# Altium schematic sheet DCDCsim.SchDoc
size Tabloid; SheetNumber: 1; SheetTotal: 1; SPICEModelCacheLJWPDLZX: <root> / <DocumentId>LJWPDLZX</DocumentId> / <CacheFrame Number="0"> / <Model Name="dsbas16xv2t1g" Kind="MDL"> / <Text>************************************** / *      Model Generated by MODPEX     * / *Copyright(c) Symmetry Design Systems* / *         All Rights Reserved        * / *    UNPUBLISHED LICENSED SOFTWARE   * / *   Contains Proprietary Information * / *      Which is The Property of      * / *     SYMMETRY OR ITS LICENSORS      * / *Commercial Use or Resale Restricted * / *   by Symmetry License Agreement    * / ************************************** / * Model generated on Mar  1, 18 / * MODEL FORMAT: PSpice / .MODEL Dsbas16xv2t1g d / +IS=6.75697e-09 RS=1.11407 N=1.92072 EG=1.17037 / +XTI=0.5 BV=165 IBV=0.0001 CJO=6.03442e-13 / +VJ=2.38765 M=0.1 FC=0.5 TT=5.1937e-09 / +KF=0 AF=1</Text> / </Model> / <Model Name="cout" Kind="CKT"> / <Text>*$ / .SUBCKT Cout 2 4 / R1 2 3 0.0010 / C1 3 1 1.4463631552839E-4 / R3 5 4 150 / R2 2 4 6913892.9344733935 / R4 3 26 222222.22222222222 / R6 3 7 222.22222222222223 / C5 7 1 4.3390894658517E-6 / R7 3 10 22.22222222222222 / C6 10 1 4.3390894658517E-6 / R8 3 13 2.2222222222222223 / C7 13 1 4.3390894658517E-6 / C2 26 1 4.3390894658517E-6 / R9 3 28 22222.222222222223 / C3 28 1 4.3390894658517E-6 / R10 3 29 2222.222222222222 / C4 29 1 4.3390894658517E-6 / L8 1 5 15p / R24 1 5 0.0030 / L12 5 4 1n / .ends</Text> / </Model> / </CacheFrame> / </root>
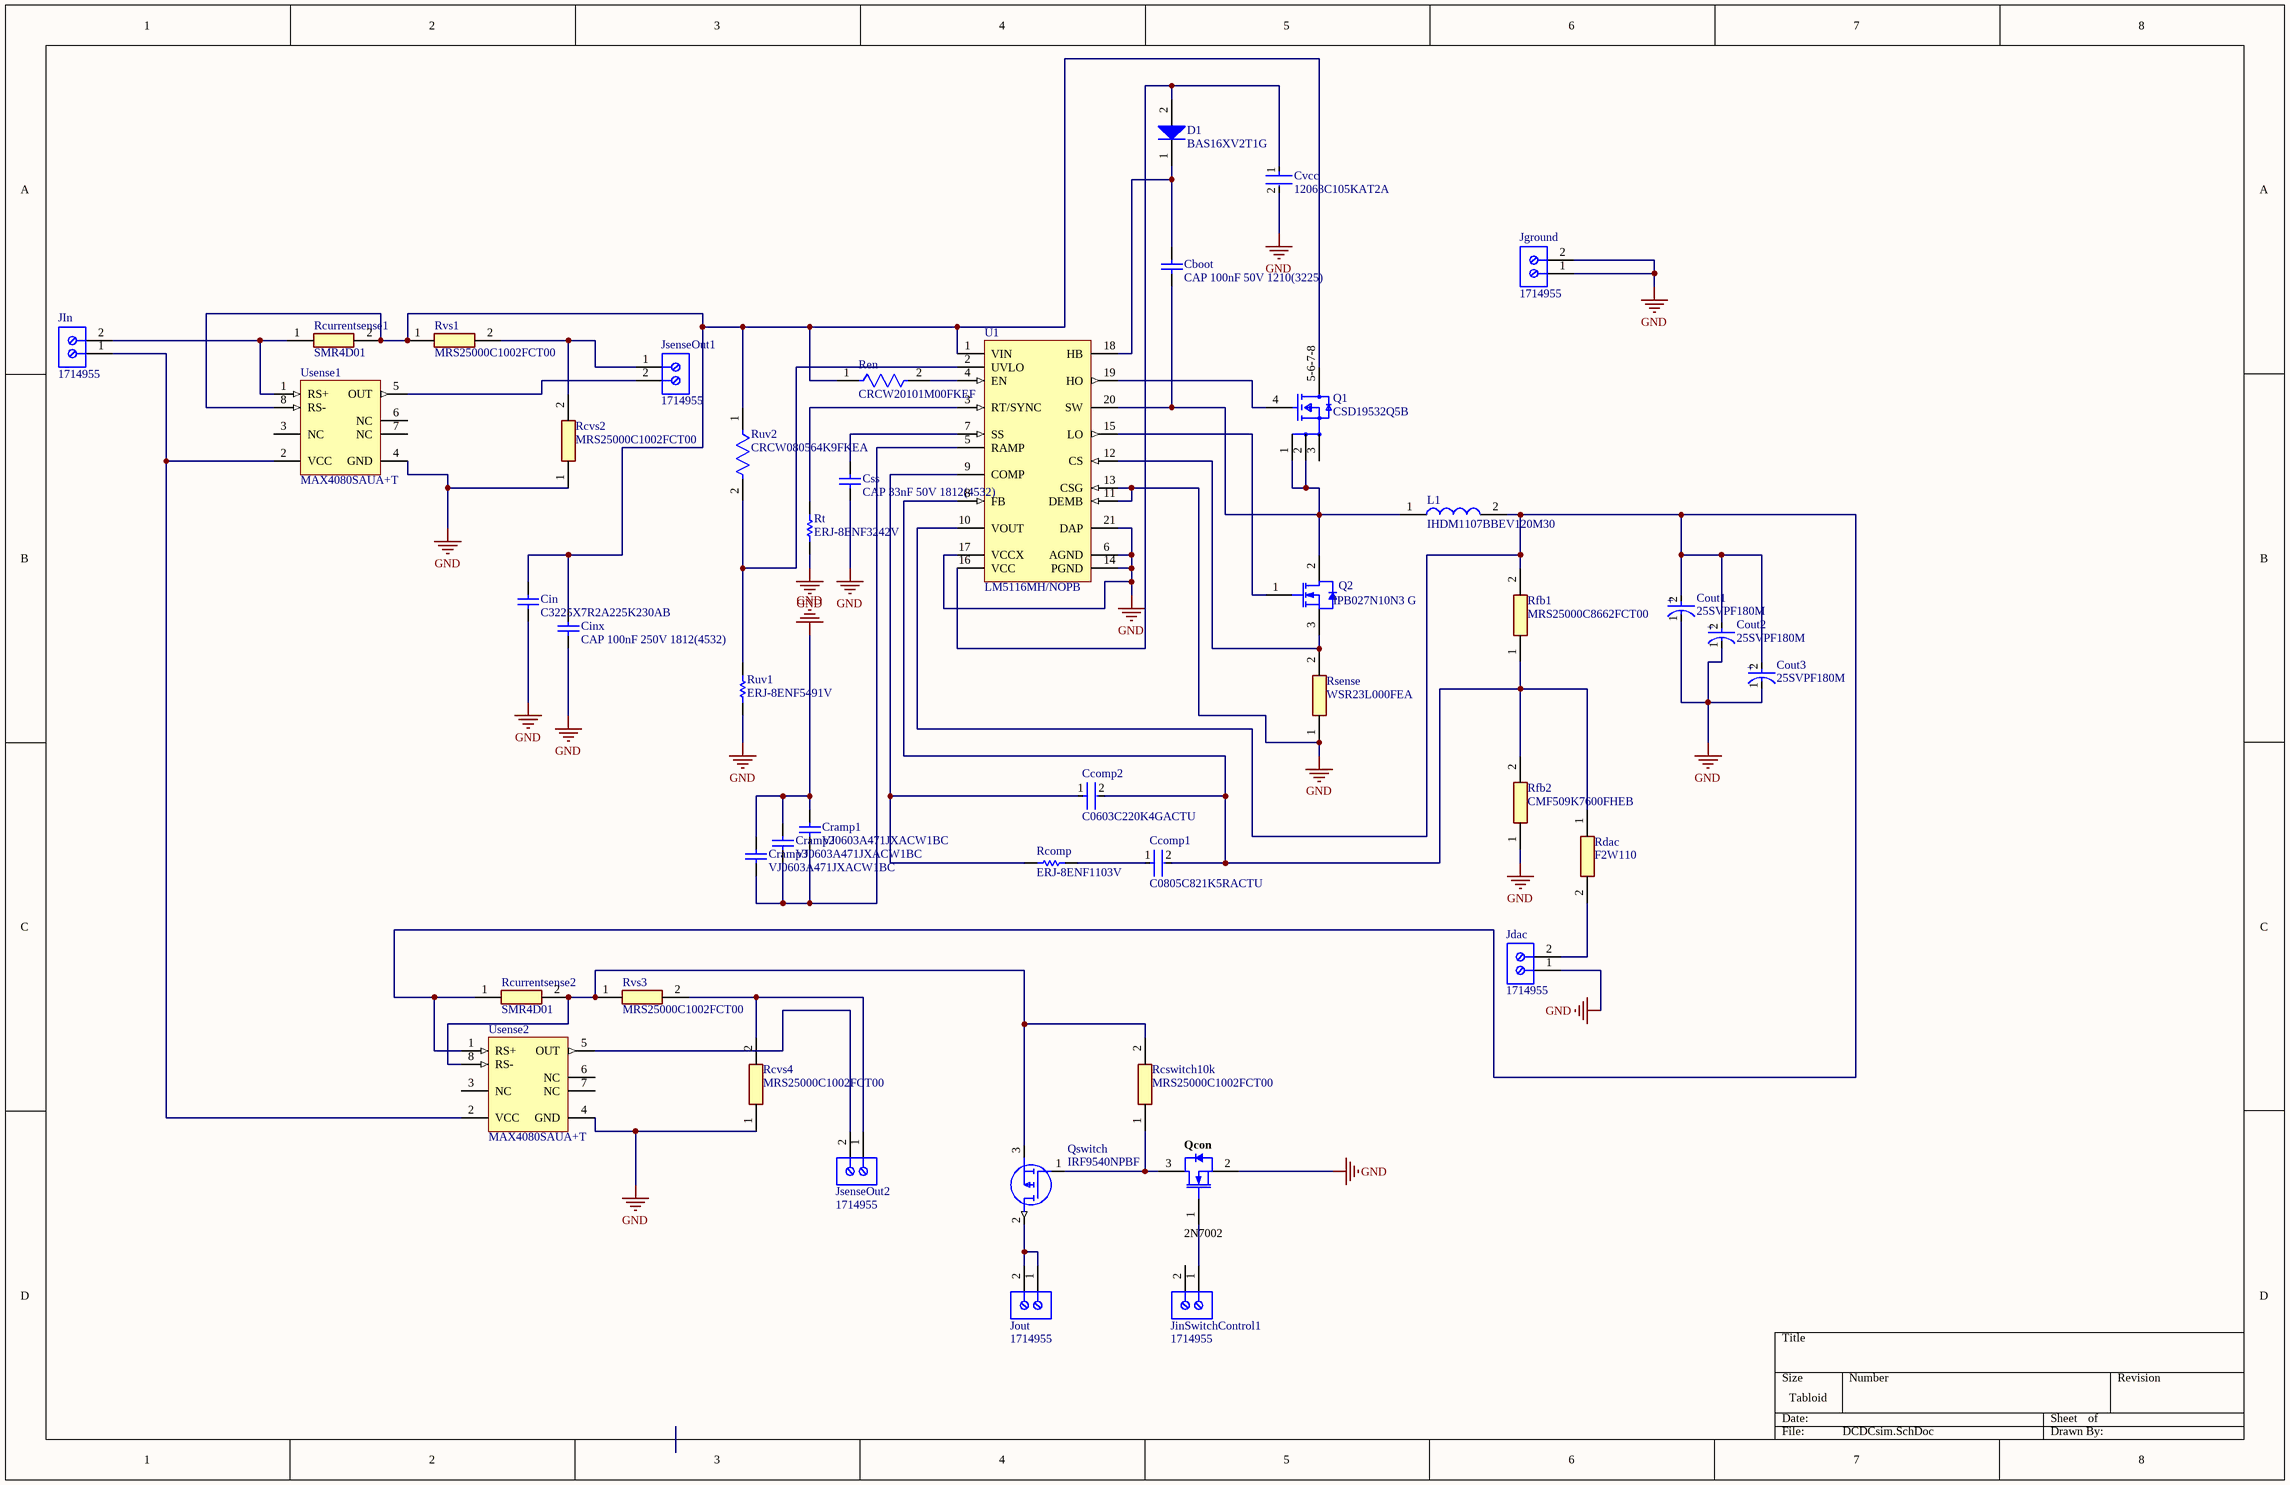
[diagram p0: DCDCsim.SchDoc]

## Parts
Cboot  CAP 100nF 50V 1210(3225)  [CAPC1210(3225)155_M]
Ccomp1  C0805C821K5RACTU  [FP-C0805C-DN-MFG]
Ccomp2  C0603C220K4GACTU  [FP-C0603C-CF-MFG]
Cin  C3225X7R2A225K230AB  [CAPC3225X250X20LL40]
Cinx  CAP 100nF 250V 1812(4532)  [CAPC1812(4532)230_M]
Cout1  25SVPF180M  [FP-OS-CON-SMT-E12-MFG]
Cout2  25SVPF180M  [FP-OS-CON-SMT-E12-MFG]
Cout3  25SVPF180M  [FP-OS-CON-SMT-E12-MFG]
Cramp1  VJ0603A471JXACW1BC  [CAPC1608X87X40ML10T15]
Cramp2  VJ0603A471JXACW1BC  [CAPC1608X87X40ML10T15]
Cramp3  VJ0603A471JXACW1BC  [CAPC1608X87X40ML10T15]
Css  CAP 33nF 50V 1812(4532)  [CAPC1812(4532)125_M]
Cvcc  12063C105KAT2A  [FP-1206-L_3_2_0_2-W_1_6_0-IPC_A]
D1  BAS16XV2T1G  [ONSC-SOD-523-2-502-01_V]
Jdac  1714955  [PHOE-1714955_V]
Jground  1714955  [PHOE-1714955_V]
JIn  1714955  [PHOE-1714955_V]
JinSwitchControl1  1714955  [PHOE-1714955_V]
Jout  1714955  [PHOE-1714955_V]
JsenseOut1  1714955  [PHOE-1714955_V]
JsenseOut2  1714955  [PHOE-1714955_V]
L1  IHDM1107BBEV120M30  [IHDM1107BBEV120M30]
Q1  CSD19532Q5B  [FP-DNK0008A-MFG]
Q2  IPB027N10N3 G  [INF-PG-TO-263-3-2_A_N]
Qcon  2N7002  [INF-PG-SOT23_M]
Qswitch  IRF9540NPBF  [TO254P469X1042X1967-3P]
Rcomp  ERJ-8ENF1103V  [RESC3216X70X50LL05T20]
Rcswitch10k  MRS25000C1002FCT00  [RESAD1650W60L650D250]
Rcurrentsense1  SMR4D01  [SMR4D01]
Rcurrentsense2  SMR4D01  [SMR4D01]
Rcvs2  MRS25000C1002FCT00  [RESAD1650W60L650D250]
Rcvs4  MRS25000C1002FCT00  [RESAD1650W60L650D250]
Rdac  F2W110  [RESAD2780W70L1140D410]
Ren  CRCW20101M00FKEF  [FP-CRCW2010-e3-MFG]
Rfb1  MRS25000C8662FCT00  [RESAD1650W60L650D250]
Rfb2  CMF509K7600FHEB  [RESAD1041W46L381D165]
Rsense  WSR23L000FEA  [RESC11670X254N]
Rt  ERJ-8ENF3242V  [RESC3216X70X50NL05T20]
Ruv1  ERJ-8ENF5491V  [RESC3216X70X50NL05T20]
Ruv2  CRCW080564K9FKEA  [FP-CRCW0805-e3-IPC_C]
Rvs1  MRS25000C1002FCT00  [RESAD1650W60L650D250]
Rvs3  MRS25000C1002FCT00  [RESAD1650W60L650D250]
U1  LM5116MH/NOPB  [PWP0020A_N]
Usense1  MAX4080SAUA+T  [MAXM-U8+1_L]
Usense2  MAX4080SAUA+T  [MAXM-U8+1_L]

## Nets
GND: Cin.1 Cinx.1 Cout1.1(C) Cout2.1(C) Cout3.1(C) Cramp1.2 Cramp2.2 Cramp3.2 Css.1 Cvcc.2 Jdac.1 Jground.1 Jground.2 Qcon.2(SOURCE) Rcvs2.1 Rcvs4.1 Rfb2.1 Rsense.1 Rt.1 Ruv1.1 U1.6(AGND) U1.11(DEMB) U1.13(CSG) U1.14(PGND) U1.17(VCCX) U1.21(DAP) Usense1.4(GND) Usense2.4(GND)
NetCboot_1: Cboot.1 L1.1 Q1.1(S) Q1.2(S) Q2.2(DRAIN) U1.20(SW)
NetCboot_2: Cboot.2 D1.1(K) U1.18(HB)
NetCcomp1_1: Ccomp1.1 Rcomp.2
NetCcomp1_2: Ccomp1.2 Ccomp2.2 Rdac.1 Rfb1.1 Rfb2.2 U1.8(FB)
NetCcomp2_1: Ccomp2.1 Rcomp.1 U1.9(COMP)
NetCin_2: Cin.2 Cinx.2 Q1.5-6-7-8(D) Rcurrentsense1.2 Ren.1 Ruv2.1 Rvs1.1 U1.1(VIN) Usense1.8(RS-)
NetCout1_2: Cout1.2(A) Cout2.2(A) Cout3.2(A) L1.2 Rcurrentsense2.1 Rfb1.2 U1.10(VOUT) Usense2.1(RS+)
NetCramp1_1: Cramp1.1 Cramp2.1 Cramp3.1 U1.5(RAMP)
NetCss_2: Css.2 U1.7(SS)
NetCvcc_1: Cvcc.1 D1.2(A) U1.16(VCC)
NetJdac_2: Jdac.2 Rdac.2
NetJIn_1: JIn.1 Usense1.2(VCC) Usense2.2(VCC)
NetJIn_2: JIn.2 Rcurrentsense1.1 Usense1.1(RS+)
NetJinSwitchControl1_1: JinSwitchControl1.1 Qcon.1(GATE)
NetJout_1: Jout.1 Jout.2 Qswitch.2(D)
NetJsenseOut1_1: JsenseOut1.1 Rcvs2.2 Rvs1.2
NetJsenseOut1_2: JsenseOut1.2 Usense1.5(OUT)
NetJsenseOut2_1: JsenseOut2.1 Rcvs4.2 Rvs3.2
NetJsenseOut2_2: JsenseOut2.2 Usense2.5(OUT)
NetQ1_4: Q1.4(G) U1.19(HO)
NetQ2_1: Q2.1(GATE) U1.15(LO)
NetQ2_3: Q2.3(SOURCE) Rsense.2 U1.12(CS)
NetQcon_3: Qcon.3(DRAIN) Qswitch.1(G) Rcswitch10k.1
NetQswitch_3: Qswitch.3(S) Rcswitch10k.2 Rcurrentsense2.2 Rvs3.1 Usense2.8(RS-)
NetRen_2: Ren.2 U1.4(EN)
NetRt_2: Rt.2 U1.3(RT/SYNC)
NetRuv1_2: Ruv1.2 Ruv2.2 U1.2(UVLO)

Not connected (* = marked no-connect by the designer): JinSwitchControl1 2; Q1 3(S); Usense1 3(NC) 6(NC) 7(NC); Usense2 3(NC) 6(NC) 7(NC)

## Notes on the sheet
- (in symbol CMP-05428-001075-1) +

## Library data of the parts
Cboot = CMP-1038-01650-1: CAP 100nF 50V ±5% 1210 (3225 Metric) Thickness 1.45mm SMD; Case-EIA: 1210; Tolerance: Â±5%; Case-Metric: 3225; Value: 100nF; Technology: SMT; Max Thickness: 1.45 mm; Rated Voltage: 50 V
Ccomp1 = CMP-2007-00409-2: 0805 C 820pF Ceramic Multilayer Capacitor; 50 VDC; +125degC; X7R Dielec; +/-10%; Manufacturer: KEMET; Tolerance: 0.1; Temperature Coefficient: 30ppm/°C; Voltage Rating: 50 V; Automotive: No; Material: Ceramic; Temperature Characteristic: X7R; Manufacturer Part Number: C0805C821K5RACTU; ComponentLink2URL: https://content.kemet.com/datasheets/KEM_C1003_C0G_SMD.pdf; Capacitance: 820 pF; Temperature Range High: +125°C; Category: Cap; Value: 820 pF; Digikey Description: 0805 C 820pF Ceramic Multilayer Capacitor; 50 VDC; +125degC; X7R Dielec; +/-10%; Device Class L2: Capacitors; Package: C0805C-DN; Temperature: -55°C to +125°C; Temperature Range Low: -55°C; Ipc Land Pattern Name: CAPC200125X78; Mouser Description: 0805 C 820pF Ceramic Multilayer Capacitor; 50 VDC; +125degC; X7R Dielec; +/-10%; Device Class L3: Ceramic Capacitors; Height: 0.88mm; Device Class L1: Passive Components; ComponentLink2Description: Datasheet; Lead Free: Yes; RoHS: TRUE; Octopart: https://octopart.com/c0805c821k5ractu-kemet-87425
Ccomp2 = CMP-2006-03465-2: CAP CER 22PF 16V 10% NP0 0603; Manufacturer: KEMET; Temperature Characteristic: C0G; Temperature Coefficient: 30ppm/°C; Tolerance: 0.1; Automotive Grade: Grade 1; ComponentLink2URL: https://api.kemet.com/component-edge/download/datasheet/C0603C100J5GACAUTO.pdf; Mouser Description: Multilayer Ceramic Capacitors MLCC - SMD/SMT 16volts 22pF C0G 10%; Package: C0603C-CF; Height: 0.87mm; Device Class L1: Passive Components; ComponentLink2Description: Datasheet; Device Class L3: Ceramic Capacitors; Device Class L2: Capacitors; Value: 22 pF; Temperature Range High: +125°C; Automotive: Yes; Digikey Description: CAP CER 22PF 16V 10% NP0 0603; Material: Ceramic; Category: Cap; Capacitance: 22 pF; Manufacturer Part Number: C0603C220K4GACTU; RoHS: TRUE; Octopart: https://octopart.com/c0603c220k4gactu-kemet-17097913; Temperature: -55°C to +125°C; Lead Free: Yes; Temperature Range Low: -55°C; Voltage Rating: 16 V
Cin = CMP-2000-06053-1: Chip Capacitor, 2.2 uF, +/- 10%, -55 to 125 degC, 1210 (3225 Metric), RoHS, Tape and Reel; PCN Part Number: MLCCPartNumberChange30/Nov/2012; Manufacturer: TDK; Capacitance: 2.2µF; Catalog Drawings: CSERIES_1210_2.5; Product Training Modules: SEAT,CCV,andTVCLDesignToolsGuidetoReplacinganElectrolyticCapacitorwithanMLCC; Other Names: 445-4497-6; Voltage - Rated: 100V; Temperature Coefficient: X7R; Featured Product: C-SeriesMidVoltageMLCCs; Online Catalog: CSeries,MidVoltage; Ratings: -; Mounting Technology: SurfaceMount; Height - Seated (Max): -; Applications: GeneralPurpose; Packaging: Digi-Reel®; Mounting Type: SurfaceMount,MLCC; Lead Spacing: -; Thickness (Max): 0.098"(2.50mm); Package Reference: 1210 (3225 Metric); Manufacturer URL: http://www.tdk.com/; Size / Dimension: 0.126"Lx0.098"W(3.20mmx2.50mm); Operating Temperature: -55°C~125°C; Datasheet URL: https://datasheet.ciiva.com/15192/getdatasheetpartid-725361-15192330.pdf; RoHS Information: RoHSCertificate-MLCC; Lead Style: -; Standard Package: 1; Family: CeramicCapacitors; Datasheet Version: 10/2014; Category: Capacitors; Tolerance: ±10%; Features: -; Series: C; Package Description: 2-Pin Surface Mount Device, Body 3.2 x 2.5 mm; Package / Case: 1210(3225Metric)
Cinx = CMP-1040-01320-2: CAP 100nF 250V ±10% 1812 (4532 Metric) Thickness 2.3mm SMD; Case-EIA: 1812; Tolerance: Â±10%; Case-Metric: 4532; Value: 100nF; Max Thickness: 2.3 mm; Technology: SMT; Rated Voltage: 250 V
Cout1-Cout3 = CMP-05428-001075-1: Conductive Polymer Aluminum Solid Capacitors (OS-CON) 180uF ±20% 25V; Polarity: Polar; Ripple Current (AC): 4.65A; Dissipation Factor: 12%; ESR (Equivalent Series Resistance): 16mR; Life (Hours): 5000Hour; Leakage Current: 900uA; Voltage Rating (DC): 25V; Height: 11.9mm; REACH SVHC: No SVHC; Number of Pins: 12; Series: OS-CON™, SVPF; Length: 11.9mm; Packaging: Tape and Reel; Case/Package: Radial; Diameter: 8mm; Voltage: 25V; Lead Free: Lead Free; Height - Seated (Max): 0.472inch; Ripple Current: 4.65A; Package Quantity: 400; Tolerance: 20%; Max Operating Temperature: 105°C; RoHS Compliant: Yes; Mount: Surface Mount; Termination: SMD/SMT; Voltage Rating: 25V; Capacitance: 180uF; Min Operating Temperature: -55°C
Cramp1-Cramp3 = CMP-2006-02033-1: Manufacturer: Vitramon; Part Number: VJ0603A471JXACW1BC
Css = CMP-1040-01069-2: CAP 33nF 50V ±5% 1812 (4532 Metric) Thickness 1.25mm SMD; Case-Metric: 4532; Tolerance: Â±5%; Case-EIA: 1812; Max Thickness: 1.25 mm; Rated Voltage: 50 V; Technology: SMT; Value: 33nF
Cvcc = CMP-04427-000096-1: General Purpose Ceramic Capacitor, 1206, 1uF, 10%, X7R, 15%, 25V; Dissipation Factor: 3%; Insulation Resistance: 100GR; Case Code (Metric): 3216; Length: 3.2mm; Size: 1.78mm; Radiation Hardening: No; Construction: Flat; Capacitance: 1uF; Packaging: Tape and Reel; Voltage Rating (DC): 25V; Case Code (Imperial): 1206; Package Quantity: 1; Tolerance: 10%; Voltage Rating: 25V; Lead Free: Lead Free; Height: 1.78mm; Thickness: 0.07inch; Width: 1.6mm; Dielectric: X7R; Voltage: 25V; Contact Plating: Tin; Min Operating Temperature: -55°C; Number of Pins: 2; Series: -; Depth: 1.6mm; REACH SVHC: No SVHC; Case/Package: 1206; RoHS Compliant: Yes; Max Operating Temperature: 125°C; Termination: SMD/SMT; Mount: Surface Mount
D1 = CMP-1054-00076-1: Switching Diode, 2-Pin SOD-523, Pb-Free, Tape and Reel; Manufacturer: On Semiconductor; trr Max (ns): 6; Configuration: Single; IF Max (A): 0.2; ComponentLink1URL: http://www.onsemi.com/; DatasheetVersion: Rev. 7; RoHS: TRUE; PackageVersion: Rev. E, 09/2010; Packing: Tape and Reel; ComponentLink2Description: Datasheet; ComponentLink2URL: http://www.onsemi.com/pub_link/Collateral/BAS16XV2T1-D.PDF; ComponentLink3Description: Package Specification; PackageReference: SOD-523-2-502-01; ComponentLink1Description: Manufacturer URL; PartNumber: BAS16XV2T1G; Mounting Technology: Surface Mount; PackageDescription: 2-Pin SOD, Body 1.2 x 0.8 mm; ComponentLink3URL: http://www.onsemi.com/pub_link/Collateral/502-01.PDF
Jdac Jground JIn JinSwitchControl1 Jout JsenseOut1 JsenseOut2 = CMP-2000-05797-1: PC Terminal Block, Pitch 6.35 mm, 1 x 2 Position, Height 21.5 mm, Tail Lenght 5.1 mm, RoHS, Bulk; Manufacturer: Phoenix Contact; Package Description: PC Terminal Block, Pitch 6.35 mm, 1 x 2 Position, Height 21.5 mm, Tail Lenght 5.1 mm; Datasheet URL: http://media.digikey.com/pdf/Data%20Sheets/Phoenix%20Contact%20PDFs/1714955.pdf; Package Reference: 1714955; Manufacturer URL: http://www.phoenixcontact.com/; Datasheet Version: 02/2010; Mounting Technology: ThroughHole
L1 = IHDM1107BBEV120M30: Inductor; Manufacturer_Name: Vishay; Datasheet Link: https://www.vishay.com/docs/34574/ihdm-1107bb-x0.pdf; Height: 22.4mm; Manufacturer_Part_Number: IHDM1107BBEV120M30; Mouser Part Number: 70-IHDM1107BBV120M30; Mouser Price/Stock: https://www.mouser.co.uk/ProductDetail/Vishay-Dale/IHDM1107BBEV120M30?qs=XAiT9M5g4x%252B8WldDprrRlA%3D%3D
Q1 = CMP-04962-000007-1: MOSFET N-CH 100V 100A 8SON; Manufacturer: Texas Instruments; Depletion Mode: False; Number Of Channels: 1; Gate To Source Voltage: 20V; Reverse Recovery Time: 80ns; Input Capacitace At Vds: 3700pF @ 50V; Max Forward Diode Voltage: 1V; Turn Off Delay Time: 22ns; Drain To Source Resistance: 4.6mΩ; Threshold Vgs Max: 3.2V; Max Junction Temp: +150°C; Turn On Delay Time: 7ns; Pulse Drain Current: 400A; Rthja Max: 50°C/W; Typ Forward Diode Voltage: 0.8V; Reverse Recovery Charge: 249nC; Threshold Vgs Min: 2.2V; Gate Charge At Vgs: 48nC @ 10V; Power Dissipation: 3.1W; Transconductance: 84S; Temperature Range Low: -55°C; Automotive: No; RoHS: TRUE; Temperature: -55°C to +150°C; Device Class L3: MOSFETs; Continuous Drain Current: 100A; Number Of N Channels: 1; Height: 1.05mm; Mouser Description: MOSFET 100V 4.0 mOhm N-Ch NexFET Power MOSFET; Drain To Source Voltage: 100V; Temperature Range High: +150°C; Manufacturer Part Number: CSD19532Q5B; Octopart: https://octopart.com/csd19532q5b-texas+instruments-32890191; ComponentLink2URL: http://www.ti.com/lit/ds/symlink/csd19532q5b.pdf; Lead Free: Yes; Drain To Source Breakdown Voltage: 100V; Device Class L1: Discrete Semiconductors; Device Class L2: Transistors; Package: DNK0008A; Digikey Description: MOSFET N-CH 100V 100A 8SON; Category: Trans; ComponentLink2Description: Datasheet
Q2 = CMP-1091-00256-1: N-Channel OptiMOS 3 Power-Transistor, 100 V VDS, 120 A ID, -55 to 175 degC, PG-TO-263-3-2, Reel, Green; Manufacturer: Infineon; RthJA (max): 62 K/W; IDpuls (max): 480Â A; Polarity: N; Rth: 0.5Â K/W; VGS(th) (max): 3.5Â V; VDS (max): 100Â V; Green: TRUE; Ptot (max): 300Â W; QG: 155Â nC; VGS(th) (min): 2Â V; RDS (on) (max): 2.7Â mOhm; ID (max): 120Â A; Halogen-free: TRUE; Packing: Reel; ComponentLink3Description: Package Specification; PackageVersion: Rev. 01, 08/2007; ComponentLink2Description: Datasheet; PackageDescription: 3-Pin Plastic (Green) Transistor Single Outline Package, 10.06 x 8.98 mm Body, 2.54 mm Pitch; ComponentLink1URL: http://www.infineon.com/; ComponentLink2URL: http://www.infineon.com/dgdl/IPB027N10N3+G_Rev2.4.pdf?folderId=db3a304313b8b5a60113cee8763b02d7&fileId=db3a30431ce5fb52011d1ed9348e15ef; ComponentLink1Description: Manufacturer URL; DatasheetVersion: Rev. 2.4; PackageReference: PG-TO-263-3-2; ComponentLink3URL: http://www.infineon.com/dgdl/IPB026N06N_Rev2.2.pdf?folderId=db3a304313b8b5a60113cee8763b02d7&fileId=db3a3043372d5cc8013754c7b2a74f7c; Mounting Technology: Surface Mount; RthJC (max): 0.5Â K/W; PartNumber: IPB027N10N3 G
Qcon = CMP-1149-00026-1: N-Channel OptiMOS Small-Signal-Transistor, 60 V VDS, 0.3 A ID, -55 to 150 degC, PG-SOT23, Reel, Green; Manufacturer: Infineon; RDS (on) (max) (@4.5V): 4,000 mOhm; VDS (max): 60 V; IDpuls (max): 1.2Â A; QG: 0.4Â nC; RDS (on) (max): 3,000 mOhm; RthJA (max): 250 K/W; ID (max): 0.3Â A; VGS(th) (max): 2.5Â V; VGS(th) (min): 1.5Â V; Green: TRUE; Ptot (max): 0.5Â W; PackageDescription: 3-Pin Small Outline Transistor Package, 2.9 x 1.3 mm Body, 0.95 mm Pitch; Halogen-free: TRUE; ComponentLink2Description: Datasheet; ComponentLink1URL: http://www.infineon.com/; Packing: Reel; DatasheetVersion: Rev. 2.4; PartNumber: 2N7002; PackageReference: PG-SOT23; PackageVersion: Apr-08; ComponentLink3URL: http://www.infineon.com/dgdl/SOT23-Package_Overview.pdf?folderId=db3a30431936bc4b0119532290053c66&fileId=db3a30431936bc4b0119533468123c85; ComponentLink1Description: Manufacturer URL; Mounting Technology: Surface Mount; ComponentLink3Description: Package Specification; ComponentLink2URL: http://www.infineon.com/dgdl/2N7002_Rev2.4.pdf?folderId=db3a3043156fd573011622e10b5c1f67&fileId=db3a304319bc939a0119c2a9461e79e6
Qswitch = IRF9540NPBF: MOSFET (P-Channel); Manufacturer_Name: Infineon; Datasheet Link: https://www.infineon.com/dgdl/irf9540npbf.pdf?fileId=5546d462533600a401535611cfa21dc8; Height: 4.69mm; Manufacturer_Part_Number: IRF9540NPBF; Mouser Part Number: 942-IRF9540NPBF; Mouser Price/Stock: https://www.mouser.co.uk/ProductDetail/Infineon-Technologies/IRF9540NPBF?qs=9%252BKlkBgLFf0vnuA8mxUPtw%3D%3D; Arrow Part Number: IRF9540NPBF; Arrow Price/Stock: https://www.arrow.com/en/products/irf9540npbf/infineon-technologies-ag?region=europe
Rcomp = CMP-2003-00042-1: Manufacturer: Panasonic; Part Number: ERJ-8ENF1103V
Rcswitch10k Rcvs2 Rcvs4 Rvs1 Rvs3 = MRS25000C1002FCT00: Resistor; Manufacturer_Name: Vishay; Datasheet Link: http://www.vishay.com/docs/28724/mrs16m25.pdf; Manufacturer_Part_Number: MRS25000C1002FCT00; Mouser Part Number: 594-MRS25000C1002FCT; Mouser Price/Stock: https://www.mouser.co.uk/ProductDetail/Vishay-BC-Components/MRS25000C1002FCT00?qs=H30XFsNYD%2FEwip42ZXddDQ%3D%3D; Arrow Part Number: MRS25000C1002FCT00; Arrow Price/Stock: https://www.arrow.com/en/products/mrs25000c1002fct00/vishay?region=nac
Rcurrentsense1 Rcurrentsense2 = SMR4D01: Resistor; Manufacturer_Name: NTE ELECTRONICS; Datasheet Link: https://www.nteinc.com/resistor_web/pdf/surface_mnt_ww.pdf; Height: 7.2mm; Manufacturer_Part_Number: SMR4D01
Rdac = F2W110: Resistor; Manufacturer_Name: NTE ELECTRONICS; Datasheet Link: https://www.nteinc.com/resistor_web/pdf/1w_2w_fusible.pdf; Manufacturer_Part_Number: F2W110
Ren = CMP-02407-002751-1: RES Thick Film, 1MΩ, 1%, 0.75W, 100ppm/°C, 2010; Max Power Dissipation: 750mW; Voltage Rating: 400V; Resistance: 1MR; Max Operating Temperature: 155°C; Height: 0.028inch; Case Code (Imperial): 2010; Number of Pins: 2; Number of Terminations: 2; Min Operating Temperature: -55°C; Radiation Hardening: No; Power Rating: 750mW; Termination: SMD/SMT; Contact Plating: Tin; Package Quantity: 1; Depth: 2.5mm; Lead Free: Lead Free; Weight: 0.000899oz; Width: 2.5mm; Packaging: Tape and Reel; Case Code (Metric): 5025; Military Standard: Not; Composition: Thick Film; Tolerance: 1%; Features: Automotive AEC-Q200; Voltage Rating (DC): 400V; Length: 5mm; Case/Package: 2010; Temperature Coefficient: 100ppm/°C
Rfb1 = MRS25000C8662FCT00: Resistor; Manufacturer_Name: Vishay; Datasheet Link: http://www.vishay.com/docs/28724/mrs16m25.pdf; Manufacturer_Part_Number: MRS25000C8662FCT00
Rfb2 = CMF509K7600FHEB: Resistor; Manufacturer_Name: Vishay; Datasheet Link: http://www.vishay.com/docs/31018/cmfind.pdf; Manufacturer_Part_Number: CMF509K7600FHEB
Rsense = WSR23L000FEA: Resistor; Manufacturer_Name: Vishay; Datasheet Link: https://www.vishay.com/docs/30101/wsr.pdf; Height: 2.537mm; Manufacturer_Part_Number: WSR23L000FEA
Rt = CMP-2003-00304-1: Manufacturer: Panasonic; Part Number: ERJ-8ENF3242V
Ruv1 = CMP-2003-00421-1: Manufacturer: Panasonic; Part Number: ERJ-8ENF5491V
Ruv2 = CMP-02407-008575-1: RES Thick Film, 64.9kΩ, 1%, 0.125W, 100ppm/°C, 0805; Power Rating: 125mW; Resistance: 64.9kR; Voltage Rating: 150V; Max Operating Temperature: 155°C; Case Code (Metric): 2012; Height: 0.45mm; Min Operating Temperature: -55°C; Weight: 0.000194oz; Length: 2mm; Temperature Coefficient: 100ppm/°C; Number of Pins: 2; Features: Automotive AEC-Q200; Termination: SMD/SMT; Composition: Thick Film; Case/Package: 0805; Number of Terminations: 2; Packaging: Tape and Reel; Package Quantity: 10; Max Power Dissipation: 125mW; Tolerance: 1%; Depth: 1.25mm; Contact Plating: Tin; Military Standard: Not; Case Code (Imperial): 0805; Radiation Hardening: No; Width: 0.049inch
U1 = CMP-0069-01480-3: Wide Range Synchronous Buck Controller, 20-pin TSSOP-EP, Pb-Free; Manufacturer: Texas Instruments; PowerWise: Y; CompType: Switcher; PackageTopMarking: NSUZXYTT*LM5116*MH; PackageReference: PWP0020A; RoHS: Y; ComponentLink1URL: http://www.ti.com/general/docs/lit/getliterature.tsp?genericPartNumber=LM5116&fileType=pdf; PackageDescription: Molded TSSOP, Jedec, 6.5 x 4.4 x 0.9mm Body, 20 Lead, 0.65mm Pitch, Exposed Pad; PinCount: 20; Code_JEDEC: MO-153-ACT; ComponentLink1Description: Datasheet URL
Usense1 Usense2 = CMP-0252-00376-1: 76 V, High-Side, Uni-directional Current-Sense Amplifier, 60 V / V Gain, -40 to 125 degC, 8-Pin SOP (U8+1), Pb-Free, Tape and Reel; Industry Qualified: Automotive - AECQ100, Automotive - General; Gain: 5 V/V, 20 V/V ,60 V/V; Bi-Dir. Curr. Sense: No; PackageReference: U8+1; PartNumber: MAX4080SAUA+T; ComponentLink3URL: http://pdfserv.maximintegrated.com/package_dwgs/21-0036.PDF; DatasheetVersion: Rev. 4; ComponentLink2Description: Datasheet; ComponentLink3Description: Package Specification; PackageVersion: Rev. L, 08/2009; Code_JEDEC: MO-187; ComponentLink1Description: Manufacturer URL; Mounting Technology: Surface Mount; PackageDescription: 8-Pin Micro-MAX, Thin Shrink Small-Outline (U8+1), Body 3 x 3 mm, Pitch 0.65 mm; ComponentLink2URL: http://datasheets.maximintegrated.com/en/ds/MAX4080-MAX4081.pdf; ComponentLink1URL: http://www.maximintegrated.com/